# EAGLE design controller (EAGLE 5.11)
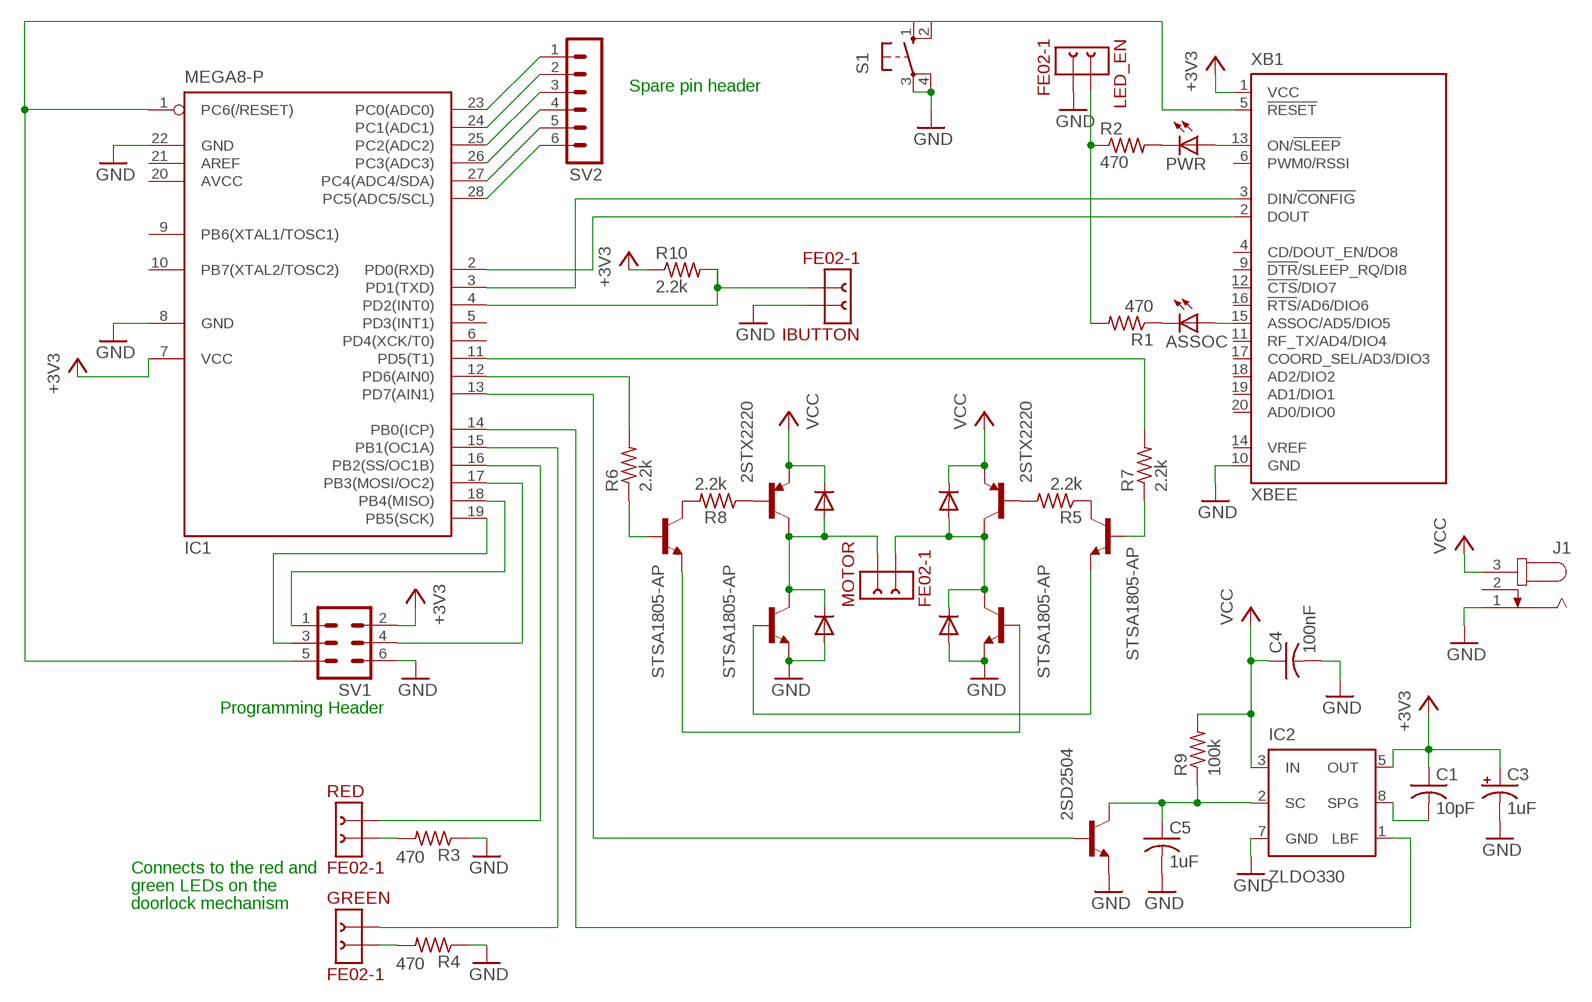
[diagram p0: schematic, sheet 1]

## Parts
ASSOC  LED3MM  [LED3MM]
C1  10pF  C-US025-030X050  [C025-030X050]
C3  1uF  CPOL-USE2-5  [E2-5]
C4  100nF  C-US025-030X050  [C025-030X050]
C5  1uF  C-US025-030X050  [C025-030X050]
D1  GF1  [SMA-DO214AC]
D2  GF1  [SMA-DO214AC]
D3  GF1  [SMA-DO214AC]
D4  GF1  [SMA-DO214AC]
GREEN  FE02-1  [FE02-1]
IBUTTON  FE02-1  [FE02-1]
IC1  MEGA8-P  [DIL28-3]
IC2  ZLDO330  [SM8]
J1  JACK-PLUG1  [SPC4078]
LED_EN  FE02-1  [FE02-1]
MOTOR  FE02-1  [FE02-1]
PWR  LED3MM  [LED3MM]
R1  470  R-US_M0805  [M0805]
R2  470  R-US_M0805  [M0805]
R3  470  R-US_M0805  [M0805]
R4  470  R-US_M0805  [M0805]
R5  2.2k  R-US_M0805  [M0805]
R6  2.2k  R-US_M0805  [M0805]
R7  2.2k  R-US_M0805  [M0805]
R8  2.2k  R-US_M0805  [M0805]
R9  100k  R-US_M0805  [M0805]
R10  2.2k  R-US_M0805  [M0805]
RED  FE02-1  [FE02-1]
S1  10-XX  [B3F-10XX]
SV1  MA03-2  [MA03-2]
SV2  MA06-1  [MA06-1]
U$1  STSA1805-AP  [TO-92]
U$2  2STX2220  [TO-92]
U$3  2STX2220  [TO-92]
U$4  STSA1805-AP  [TO-92]
U$5  2SD2504  [TO-92]
U$6  STSA1805-AP  [TO-92]
U$7  STSA1805-AP  [TO-92]
XB1  XBEE  [XBEE]

## Nets
+3V3: C1.1 C3.+ IC1.7(VCC) IC2.5(OUT) R10.1 SV1.2 XB1.1(VCC)
GND: C3.- C4.2 C5.2 D2.A D3.A IBUTTON.P$1 IC1.8(GND) IC1.22(GND) IC2.7(GND) J1.1 LED_EN.P$2 R3.1 R4.1 S1.3(P) S1.4(P1) SV1.6 U$1.1(E) U$4.1(E) U$5.1(E) XB1.10(GND)
N$1: PWR.A XB1.13(ON/!SLEEP)
N$2: ASSOC.A XB1.15(ASSOC/AD5/DIO5)
N$3: PWR.K(C) R2.2
N$4: ASSOC.K(C) R1.1
N$5: LED_EN.P$1 R1.2 R2.1
N$6: IC1.2(PD0(RXD)) XB1.2(DOUT)
N$7: IC1.3(PD1(TXD)) XB1.3(DIN/!CONFIG)
N$8: S1.1(S) XB1.5(!RESET)
N$9: IC1.1(PC6(/RESET)) S1.2(S1) SV1.5
N$10: R3.2 RED.P$2
N$11: GREEN.P$2 R4.2
N$12: GREEN.P$1 IC1.15(PB1(OC1A))
N$13: IC1.13(PD7(AIN1)) U$5.3(B)
N$14: D3.K(C) D4.A MOTOR.P$2 U$3.1(C) U$4.3(C)
N$15: D1.A D2.K(C) MOTOR.P$1 U$1.3(C) U$2.1(C)
N$16: R8.1 U$2.2(B)
N$17: R5.2 U$3.2(B)
N$18: R6.1 U$6.2(B)
N$19: R5.1 U$7.3(C)
N$20: IC1.18(PB4(MISO)) SV1.1
N$21: IC1.11(PD5(T1)) R7.2
N$22: IC1.12(PD6(AIN0)) R6.2
N$23: IC1.17(PB3(MOSI/OC2)) SV1.4
N$24: IC1.19(PB5(SCK)) SV1.3
N$25: IBUTTON.P$2 IC1.4(PD2(INT0)) R10.2
N$26: C1.2 IC2.8(SPG)
N$27: IC1.14(PB0(ICP)) IC2.1(LBF)
N$28: IC1.16(PB2(SS/OC1B)) RED.P$1
N$29: C5.1 IC2.2(SC) R9.1 U$5.2(C)
N$30: IC1.28(PC5(ADC5/SCL)) SV2.6
N$31: IC1.27(PC4(ADC4/SDA)) SV2.5
N$32: IC1.26(PC3(ADC3)) SV2.4
N$33: IC1.25(PC2(ADC2)) SV2.3
N$34: IC1.24(PC1(ADC1)) SV2.2
N$35: IC1.23(PC0(ADC0)) SV2.1
N$36: R8.2 U$6.3(C)
N$37: U$4.2(B) U$6.1(E)
N$38: U$1.2(B) U$7.1(E)
N$39: R7.1 U$7.2(B)
VCC: C4.1 D1.K(C) D4.K(C) IC2.3(IN) J1.3 R9.2 U$2.3(E) U$3.3(E)
Unconnected: IC1.5(PD3(INT1)) IC1.6(PD4(XCK/T0)) IC1.9(PB6(XTAL1/TOSC1)) IC1.10(PB7(XTAL2/TOSC2)) IC1.21(AREF) J1.2 XB1.4(CD/DOUT_EN/DO8) XB1.6(PWM0/RSSI) XB1.9(!DTR!/SLEEP_RQ/DI8) XB1.11(RF_TX/AD4/DIO4) XB1.12(!CTS!/DIO7) XB1.14(VREF) XB1.16(!RTS!/AD6/DIO6) XB1.17(COORD_SEL/AD3/DIO3) XB1.18(AD2/DIO2) XB1.19(AD1/DIO1) XB1.20(AD0/DIO0)

## Notes on the sheet
- Spare pin header
- Programming Header
- Connects to the red and
- green LEDs on the
- doorlock mechanism

## Power pins joined to a net without a drawn wire
AVCC: IC1.20(AVCC)

## Library data of the parts
ASSOC PWR = led:LED: LED OSRAM: - CHIPLED LG R971, LG N971, LY N971, LG Q971, LY Q971, LO R971, LY R971 LH N974, LH R974 LS Q976, LO Q976, LY Q976 LO Q996 - Hyper CHIPLED LW Q18S LB Q993, LB Q99A, LB R99A - SideLED LS A670, LO A670, LY A670, LG A670, LP A670 LB A673, LV A673, LT A673, LW A673 LH A674 LY A675 LS A676, LA A676, LO A676, LY A676, LW A676 LS A679, LY A679, LG A679 - Hyper Micro SIDELED® LS Y876, LA Y876, LO Y876, LY Y876 LT Y87S - SmartLED LW L88C, LW L88S LB L89C, LB L89S, LG L890 LS L89K, LO L89K, LY L89K LS L896, LA L896, LO L896, LY L896 - TOPLED LS T670, LO T670, LY T670, LG T670, LP T670 LSG T670, LSP T670, LSY T670, LOP T670, LYG T670 LG T671, LOG T671, LSG T671 LB T673, LV T673, LT T673, LW T673 LH T674 LS T676, LA T676, LO T676, LY T676, LB T676, LH T676, LSB T676, LW T676 LB T67C, LV T67C, LT T67C, LS T67K, LO T67K, LY T67K, LW E67C LS E67B, LA E67B, LO E67B, LY E67B, LB E67C, LV E67C, LT E67C LW T67C LS T679, LY T679, LG T679 LS T770, LO T770, LY T770, LG T770, LP T770 LB T773, LV T773, LT T773, LW T773 LH T774 LS E675, LA E675, LY E675, LS T675 LS T776, LA T776, LO T776, LY T776, LB T776 LHGB T686 LT T68C, LB T68C - Hyper Mini TOPLED® LB M676 - Mini TOPLED Santana® LG M470 LS M47K, LO M47K, LY M47K Source: http://www.osram.convergy.de LUXEON: - LUMILED® LXK2-PW12-R00, LXK2-PW12-S00, LXK2-PW14-U00, LXK2-PW14-V00 LXK2-PM12-R00, LXK2-PM12-S00, LXK2-PM14-U00 LXK2-PE12-Q00, LXK2-PE12-R00, LXK2-PE12-S00, LXK2-PE14-T00, LXK2-PE14-U00 LXK2-PB12-K00, LXK2-PB12-L00, LXK2-PB12-M00, LXK2-PB14-N00, LXK2-PB14-P00, LXK2-PB14-Q00 LXK2-PR12-L00, LXK2-PR12-M00, LXK2-PR14-Q00, LXK2-PR14-R00 LXK2-PD12-Q00, LXK2-PD12-R00, LXK2-PD12-S00 LXK2-PH12-R00, LXK2-PH12-S00 LXK2-PL12-P00, LXK2-PL12-Q00, LXK2-PL12-R00 Source: www.luxeon.com KINGBRIGHT: KA-3528ASYC Source: www.kingbright.com
C1 C4 C5 = resistor:C-US: CAPACITOR, American symbol
C3 = resistor:CPOL-US: POLARIZED CAPACITOR, American symbol
D1-D4 = diode:GF1: DIODE
GREEN IBUTTON LED_EN MOTOR RED = gatekeeper:FE02-1
IC1 = atmel:MEGA8-P: MICROCONTROLLER 8 Kbytes FLASH, 1 kbytes SRAM, 512 bytes EEPROM, USART, 4-channel 10 bit ADC, 2-channel 8 bit ADC Pin compatible with Atmega48, ATMega88, ATMega168 Source: avr.lbr; OC_FARNELL: unknown; OC_NEWARK: unknown
IC2 = random_parts:ZLDO330
J1 = con-jack:JACK-PLUG: DC POWER JACK Power Jack, DC, Right Angle, Through Hole, Rated 5A at 16VDC, PC Terminals Distributor: Farnell (www.Farnell.de) Drawing: 84N1161.pdf / 84N1162.pdf Manufacturer: SPC Technology (www.spctechnology.com) Type: SPC4077 / SPC 4078
R1-R10 = resistor:R-US_: RESISTOR, American symbol
S1 = switch-omron:10-XX: OMRON SWITCH; MPN: B3F-1000; OC_FARNELL: 176432; OC_NEWARK: 36M3542
SV1 = con-lstb:MA03-2: PIN HEADER
SV2 = con-lstb:MA06-1: PIN HEADER
U$1 U$4 U$6 U$7 = gatekeeper:STSA1805-AP
U$2 U$3 = gatekeeper:2STX2220
U$5 = gatekeeper:2SD2504
XB1 = maxstream:XBEE: XBee (TM) /XBee-PRO(TM) OEM RF Modules Source: MaxStream, Inc. xbee_productmanual.pdf; MPN: XBP24-Z7UIT-004; OC_FARNELL: 1751799; OC_NEWARK: 34R5507

## Board
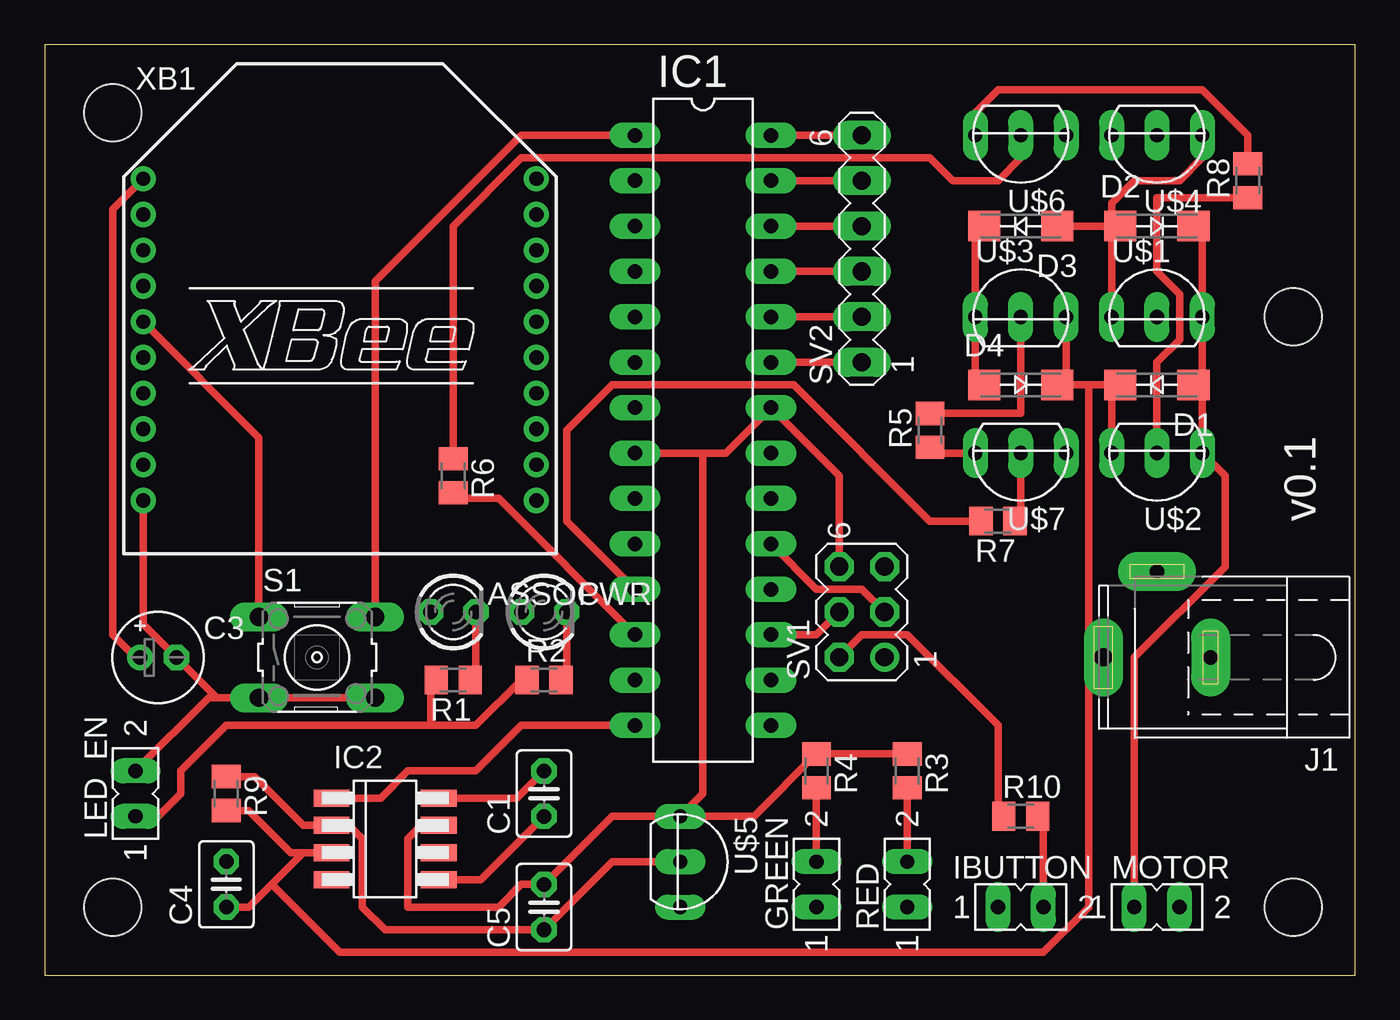
[diagram p1: board, top side]
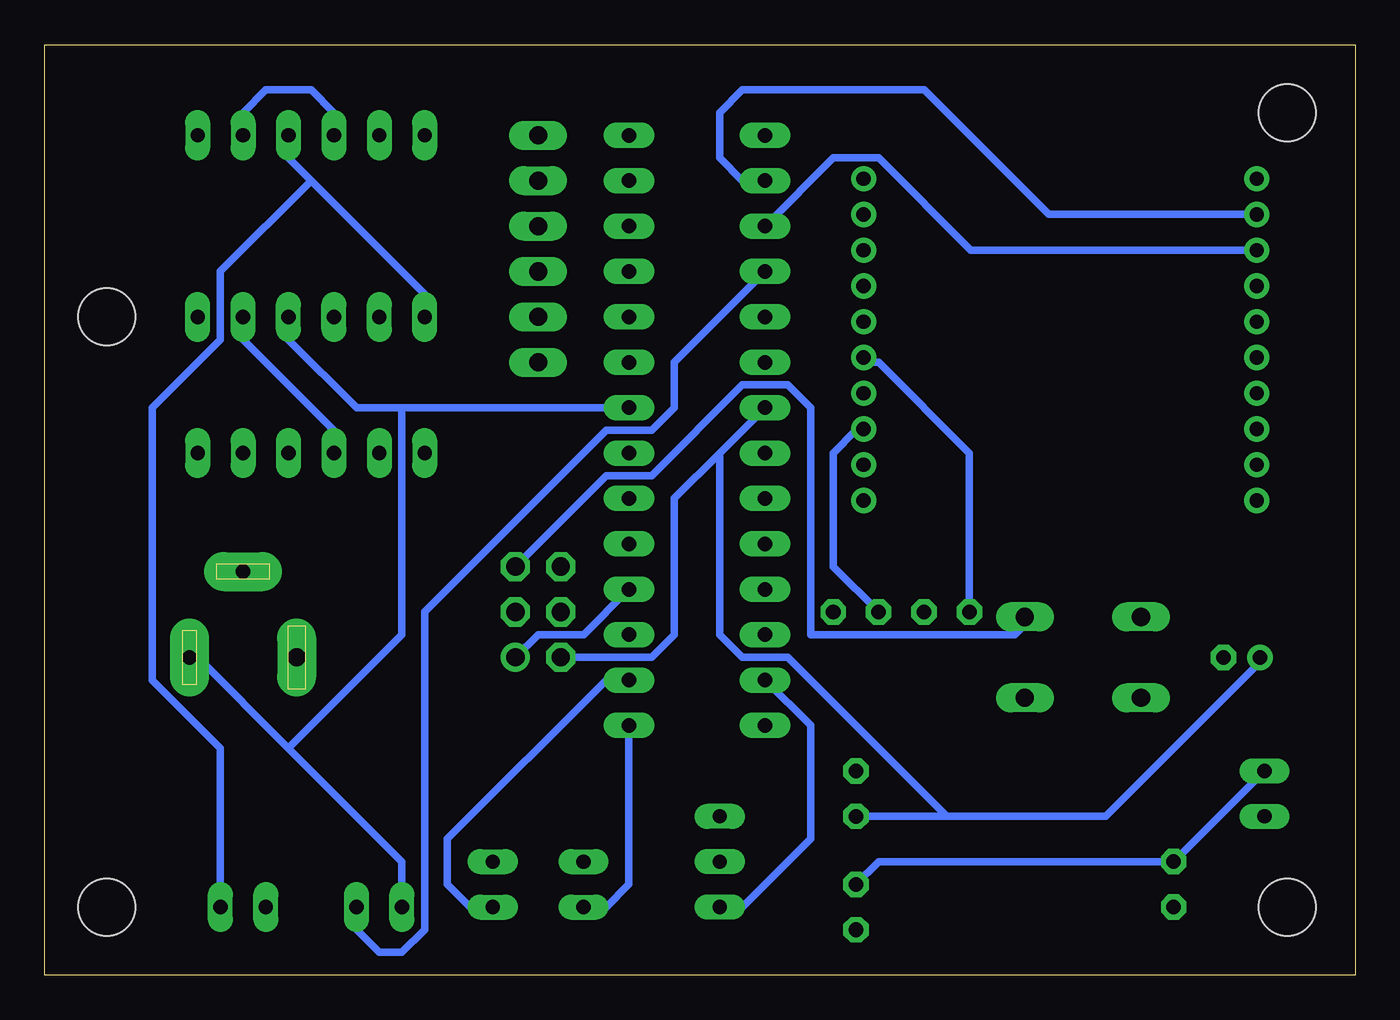
[diagram p2: board, bottom side, seen from below]

Size 73.33 x 52.06 mm. Coordinates in mm from the lower left corner, seen from the top.
Outline: 0,0 73.33,0 73.33,52.06 0,52.06 0,0
Copper layers (1*16): Top 0.035mm / dielectric 1.5mm / Bottom 0.035mm
Design rules "SparkFun": minimum track width 8mil, minimum drill 20mil, track to track 8mil, track to pad 8mil, pad to pad 8mil, via to via 8mil, smd to smd 8mil, copper to edge 10mil, drill to drill 8mil, minimum pad ring 12mil, minimum via ring 10mil, stop-mask expansion 4mil, vias tented up to drill 25mil, thermal gap 10mil
Holes 3.2 mm at 3.81,48.26 3.81,3.81 69.85,3.81 69.85,36.83

### Footprints (pad centres in the part's own frame; a part is rotated, then mirrored left to right if it is on the bottom)
LED3MM = drill 0.813 octagon: A -1.27,0; K 1.27,0
C025-030X050 = drill 0.813 octagon: 1 -1.27,0; 2 1.27,0
E2-5 = drill 0.813 pad 1.27 round: + -1.016,0 | drill 0.813 pad 1.27 octagon: - 1.016,0
SMA-DO214AC = smd 1.8 x 1.7: A -2.05,0; K 2.05,0
FE02-1 = drill 0.8 long: P$1 -1.27,0; P$2 1.27,0
DIL28-3 = drill 0.813 long: 1 -16.51,-3.81; 2 -13.97,-3.81; 3 -11.43,-3.81; 4 -8.89,-3.81; 5 -6.35,-3.81; 6 -3.81,-3.81; 7 -1.27,-3.81; 8 1.27,-3.81; 9 3.81,-3.81; 10 6.35,-3.81; 11 8.89,-3.81; 12 11.43,-3.81; 13 13.97,-3.81; 14 16.51,-3.81; 15 16.51,3.81; 16 13.97,3.81; 17 11.43,3.81; 18 8.89,3.81; 19 6.35,3.81; 20 3.81,3.81; 21 1.27,3.81; 22 -1.27,3.81; 23 -3.81,3.81; 24 -6.35,3.81; 25 -8.89,3.81; 26 -11.43,3.81; 27 -13.97,3.81; 28 -16.51,3.81
SM8 = smd 0.95 x 2: 1 -2.28,-3; 2 -0.76,-3; 3 0.76,-3; 4 2.28,-3; 5 2.28,3; 6 0.76,3; 7 -0.76,3; 8 -2.28,3
SPC4078 = drill 0.8 pad 2.184 long: 1 -3,0; 2 0,-4.8 | drill 1 pad 2.184 long: 3 3,0
M0805 = smd 1.3 x 1.6: 1 -0.95,0; 2 0.95,0
B3F-10XX = drill 1.016 long: 1 -3.251,2.261; 2 3.251,2.261; 3 -3.251,-2.261; 4 3.251,-2.261
MA03-2 = drill 1.016 round: 1 -2.54,-1.27 | drill 1.016 octagon: 2 -2.54,1.27; 3 0,-1.27; 4 0,1.27; 5 2.54,-1.27; 6 2.54,1.27
MA06-1 = drill 1.016 long: 1 -6.35,0; 2 -3.81,0; 3 -1.27,0; 4 1.27,0; 5 3.81,0; 6 6.35,0
TO-92 = drill 0.8 long: 1 -2.54,0; 2 0,0; 3 2.54,0
XBEE = drill 0.8 pad 1.27 round: 1 -11,9; 2 -11,7; 3 -11,5; 4 -11,3; 5 -11,1; 6 -11,-1; 7 -11,-3; 8 -11,-5; 9 -11,-7; 10 -11,-9; 11 11,-9; 12 11,-7; 13 11,-5; 14 11,-3; 15 11,-1; 16 11,1; 17 11,3; 18 11,5; 19 11,7; 20 11,9

### Placement (x,y rotation side)
ASSOC  22.86,20.32 0 top
C1  27.94,10.16 90 top
C3  6.35,17.78 0 top
C4  10.16,5.08 90 top
C5  27.94,3.81 90 top
D1  62.23,33.02 180 top
D2  62.23,41.91 0 top
D3  54.61,41.91 180 top
D4  54.61,33.02 0 top
GREEN  43.18,5.08 90 top
IBUTTON  54.61,3.81 0 top
IC1  36.83,30.48 270 top
IC2  19.05,7.62 270 top
J1  62.23,17.78 180 top
LED_EN  5.08,10.16 90 top
MOTOR  62.23,3.81 0 top
PWR  27.94,20.32 0 top
R1  22.86,16.51 180 top
R2  27.94,16.51 0 top
R3  48.26,11.43 270 top
R4  43.18,11.43 270 top
R5  49.53,30.48 90 top
R6  22.86,27.94 270 top
R7  53.34,25.4 180 top
R8  67.31,44.45 90 top
R9  10.16,10.16 270 top
R10  54.61,8.89 0 top
RED  48.26,5.08 90 top
S1  15.24,17.78 0 top
SV1  45.72,20.32 90 top
SV2  45.72,40.64 90 top
U$1  62.23,36.83 0 top
U$2  62.23,29.21 180 top
U$3  54.61,36.83 0 top
U$4  62.23,46.99 180 top
U$5  35.56,6.35 270 top
U$6  54.61,46.99 180 top
U$7  54.61,29.21 180 top
XB1  16.51,35.56 0 top

### Tracks (layer width: path | path; a pad name or v marks a point on that pad's centre or on a via)
+3V3
  Top 0.406: IC2.5 24.39,5.34 C1.1 | SV1.2 45.72,19.05 48.26,19.05 53.34,13.97 53.34,8.89 R10.1 | C3.+ 5.08,17.78 3.81,19.05 3.81,42.86 XB1.1
  Bottom 0.406: 35.56,29.21 38.1,26.67 38.1,19.05 39.37,17.78 SV1.2 | 35.56,29.21 IC1.7 | 22.86,8.89 13.97,8.89 5.08,17.78 C3.+ | 22.86,8.89 C1.1 | 35.56,29.21 35.56,19.05 34.29,17.78 31.75,17.78 22.86,8.89
GND
  Top 0.406: IC2.7 21.08,8.38 20.32,7.62 20.32,3.81 25.4,3.81 26.67,5.08 C5.2 31.75,8.89 U$5.1 | 59.69,41.91 D3.A | U$1.1 59.69,41.91 | 59.69,41.91 59.69,43.18 60.96,44.45 63.5,44.45 64.77,45.72 U$4.1 | 59.69,41.91 D2.A | 36.83,29.21 38.1,29.21 IC1.22 44.45,27.94 SV1.6 | 36.83,29.21 IC1.8 | U$5.1 36.83,10.16 36.83,29.21 | S1.4 S1.3 10.16,15.52 | 10.16,15.52 9.63,15.52 C3.- 5.51,19.64 XB1.10 | LED_EN.P$2 9.17,15.52 10.16,15.52 | U$5.1 39.69,8.89 R4.1 R3.1
  Bottom 0.406: LED_EN.P$2 C4.2 26.67,6.35 C5.2 | IBUTTON.P$1 53.34,6.35 59.69,12.7 | 59.69,12.7 64.77,17.78 J1.1 | U$1.1 59.69,35.56 55.88,31.75 53.34,31.75 | IC1.22 53.34,31.75 | 59.69,12.7 53.34,19.05 53.34,31.75
N$1
  Bottom 0.406: PWR.A 29.21,22.86 29.21,29.21 27.94,30.48 XB1.13
N$2
  Bottom 0.406: ASSOC.A 21.59,29.21 26.67,34.29 27.94,34.29 XB1.15
N$3
  Top 0.406: PWR.K 29.21,16.51 R2.2
N$4
  Top 0.406: ASSOC.K 24.13,16.51 R1.1
N$5
  Top 0.406: 21.59,13.97 21.59,16.51 R1.2 | 21.59,13.97 24.13,13.97 26.67,16.51 R2.1 | LED_EN.P$1 6.35,8.89 7.62,10.16 7.62,11.43 10.16,13.97 21.59,13.97
N$6
  Bottom 0.406: XB1.2 17.16,42.56 24.13,49.53 34.29,49.53 35.56,48.26 35.56,45.72 34.29,44.45 IC1.2
N$7
  Bottom 0.406: IC1.3 29.21,45.72 26.67,45.72 21.51,40.56 XB1.3
N$8
  Top 0.406: XB1.5 11.99,30.08 S1.1
N$9
  Top 0.406: IC1.1 26.67,46.99 19.05,39.37 18.49,38.81 S1.2
  Bottom 0.406: SV1.5 41.91,27.94 39.37,27.94 34.29,33.02 31.75,33.02 30.48,31.75 30.48,19.05 19.05,19.05 18.49,19.61 S1.2
N$10
  Top 0.406: RED.P$2 R3.2
N$11
  Top 0.406: GREEN.P$2 R4.2
N$12
  Bottom 0.406: GREEN.P$1 41.91,3.81 40.64,5.08 40.64,6.35 IC1.15
N$13
  Bottom 0.406: U$5.3 34.29,3.81 30.48,7.62 30.48,13.97 IC1.13
N$14
  Top 0.406: D4.A 52.07,33.02 U$3.1 52.07,41.91 D3.K
  Bottom 0.406: U$4.3 59.69,45.72 58.42,44.45 | 58.42,44.45 52.07,38.1 U$3.1 | MOTOR.P$2 63.5,12.7 67.31,16.51 67.31,31.75 63.5,35.56 63.5,39.37 58.42,44.45
N$15
  Top 0.406: 64.77,33.02 U$1.3 64.77,41.91 D2.K | MOTOR.P$1 60.96,17.78 66.04,22.86 66.04,27.94 U$2.1 64.77,33.02 | 64.77,33.02 D1.A
N$16
  Top 0.406: U$2.2 62.23,34.29 63.5,35.56 63.5,38.1 62.23,39.37 62.23,43.5 R8.1
N$17
  Top 0.406: R5.2 54.61,31.43 U$3.2
N$18
  Top 0.406: U$6.2 54.61,45.72 53.34,44.45 50.8,44.45 49.53,45.72 26.67,45.72 22.86,41.91 R6.1
N$19
  Top 0.406: U$7.3 49.53,29.21 R5.1
N$20
  Bottom 0.406: IC1.18 43.18,19.05 45.72,19.05 SV1.1
N$21
  Top 0.406: IC1.11 29.21,25.4 29.21,30.48 31.75,33.02 41.91,33.02 49.53,25.4 R7.2
N$22
  Top 0.406: IC1.12 25.4,26.67 22.86,26.67 R6.2
N$23
  Top 0.406: IC1.17 43.18,19.05 SV1.4
N$24
  Top 0.406: IC1.19 43.18,21.59 45.72,21.59 SV1.3
N$25
  Top 0.406: IBUTTON.P$2 55.88,8.89 R10.2
  Bottom 0.406: IC1.4 38.1,34.29 38.1,31.75 39.37,30.48 41.91,30.48 52.07,20.32 52.07,2.54 53.34,1.27 54.61,1.27 55.88,2.54 IBUTTON.P$2
N$26
  Top 0.406: IC2.8 26.41,9.9 C1.2
N$27
  Top 0.406: IC2.1 18.79,9.9 20.32,11.43 24.13,11.43 26.67,13.97 IC1.14
N$28
  Bottom 0.406: RED.P$1 49.53,3.81 50.8,5.08 50.8,7.62 41.91,16.51 IC1.16
N$29
  Top 0.406: U$5.2 31.75,6.35 C5.1 19.05,2.54 17.78,3.81 17.78,7.62 17.02,8.38 IC2.2 14.48,8.38 11.75,11.11 R9.1
N$30
  Top 0.406: IC1.28 SV2.6
N$31
  Top 0.406: IC1.27 SV2.5
N$32
  Top 0.406: IC1.26 SV2.4
N$33
  Top 0.406: IC1.25 SV2.3
N$34
  Top 0.406: IC1.24 SV2.2
N$35
  Top 0.406: IC1.23 SV2.1
N$36
  Top 0.406: U$6.3 52.07,48.26 53.34,49.53 64.77,49.53 67.31,46.99 R8.2
N$37
  Bottom 0.406: U$6.1 57.15,48.26 58.42,49.53 59.69,49.53 60.96,49.53 62.23,48.26 U$4.2
N$38
  Bottom 0.406: U$7.1 57.15,30.48 62.23,35.56 U$1.2
N$39
  Top 0.406: U$7.2 54.61,25.4 R7.1
VCC
  Top 0.406: 15.24,6.86 14.48,6.86 12.7,5.08 | 15.24,6.86 IC2.3 | 12.7,5.08 11.43,3.81 C4.1 | 58.42,33.02 59.69,33.02 | 58.42,33.02 57.15,33.02 | 59.69,33.02 U$2.3 | 59.69,33.02 D1.K | 57.15,33.02 U$3.3 | 57.15,33.02 D4.K | 58.42,17.78 58.42,33.02 | 12.7,5.08 16.51,1.27 55.88,1.27 58.42,3.81 58.42,17.78 | 58.42,17.78 J1.3 | 15.24,6.86 13.78,6.86 11.43,9.21 R9.2

### Text on the board
tPlace: v0.1